# EAGLE schematic controller (EAGLE 7.0.0)
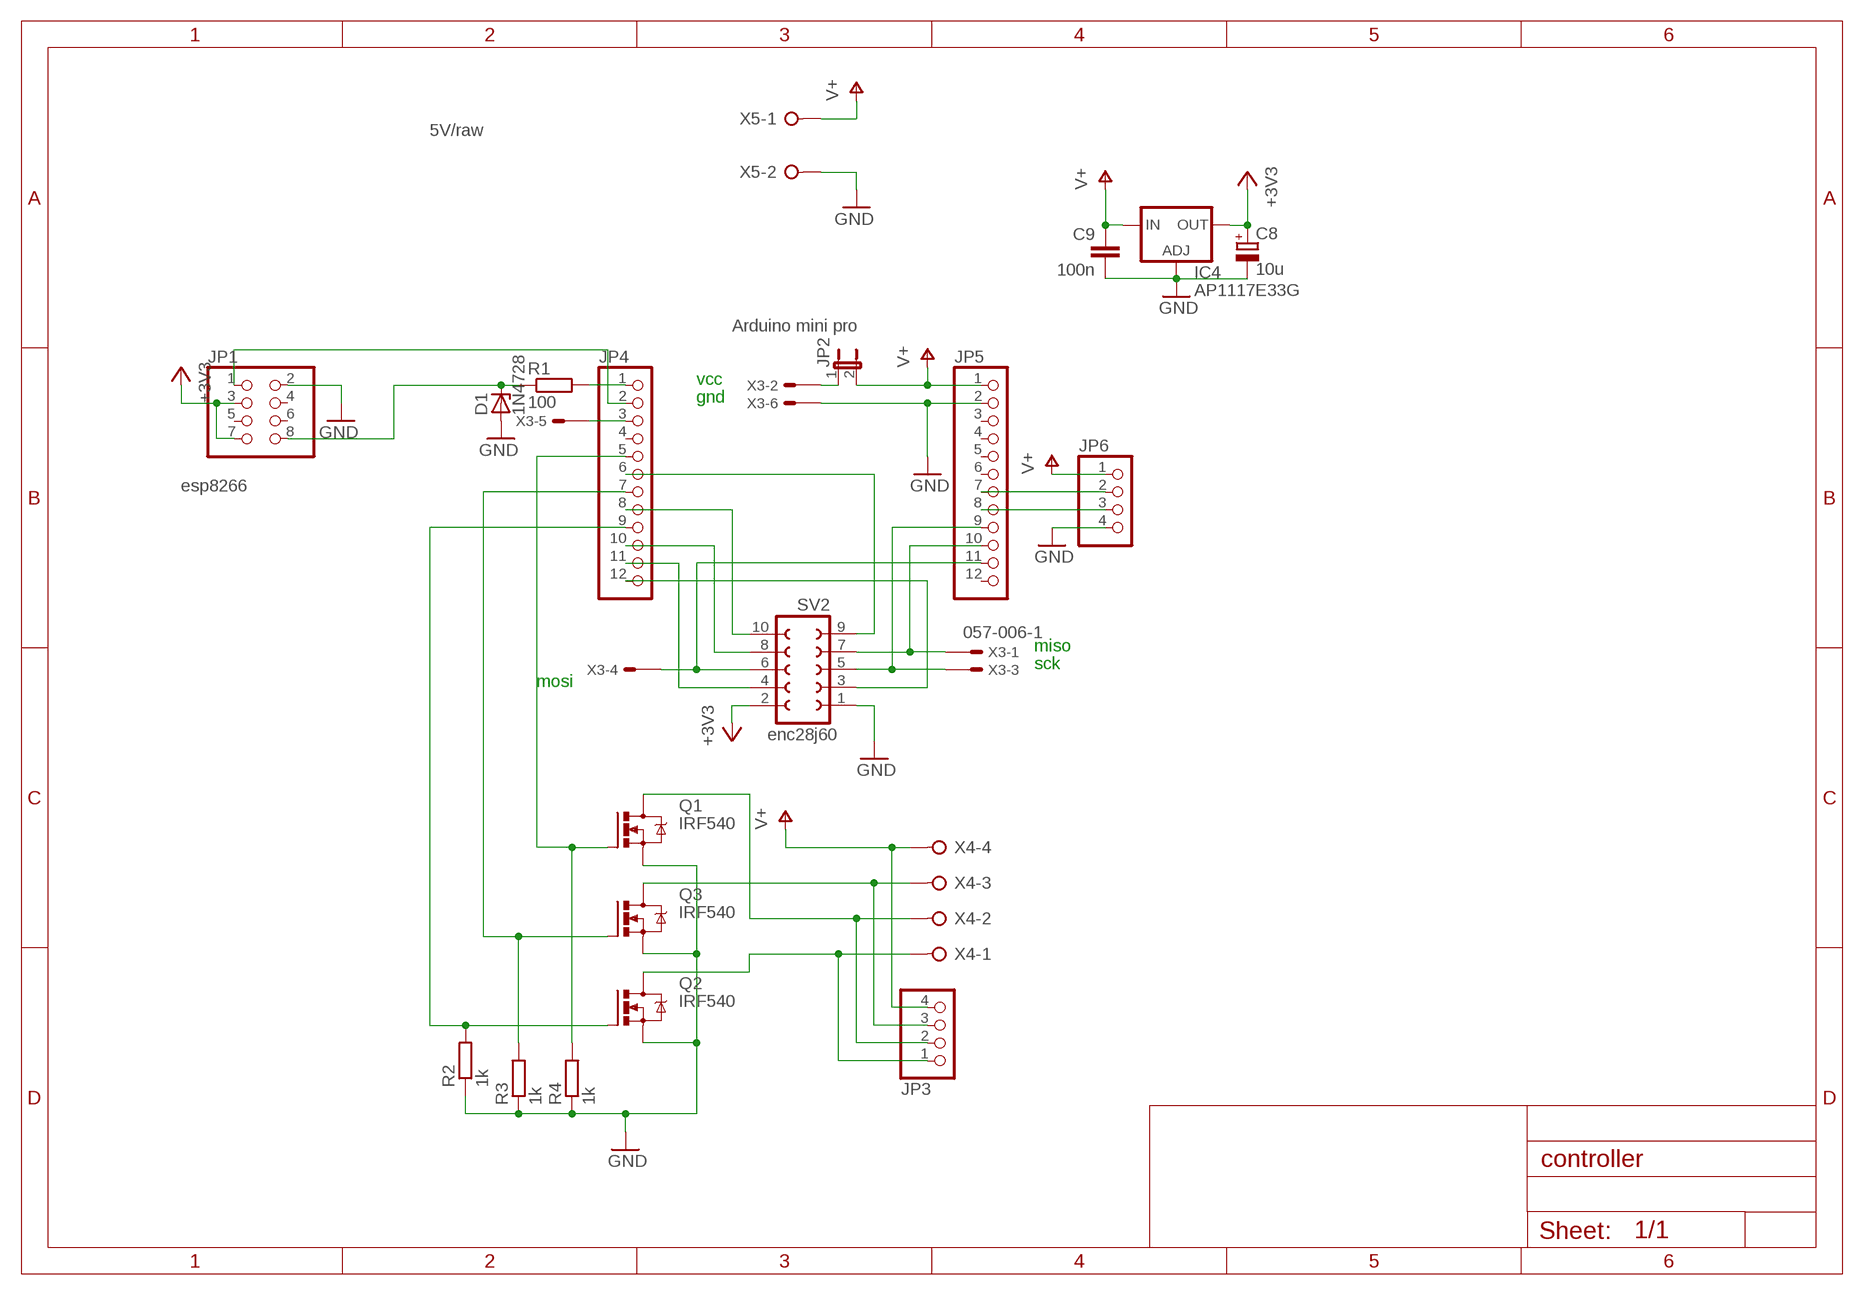
[diagram p0: schematic, sheet 1]

## Parts
C8  10u  CPOL-EUTT2D4L  [TT2D4L]
C9  100n  C-EU025-025X050  [C025-025X050]
D1  1N4728  [DO41Z10]
IC4  AP1117E33G  LD117AS33TR  [SOT223]
JP1  PINHD-2X4  [2X04]
JP2  JP1E  [JP1]
JP3  PINHD-1X4  [1X04]
JP4  PINHD-1X12  [1X12]
JP5  PINHD-1X12  [1X12]
JP6  PINHD-1X4  [1X04]
Q1  IRF540  [TO220BV]
Q2  IRF540  [TO220BV]
Q3  IRF540  [TO220BV]
R1  100  R-EU_0207/10  [0207/10]
R2  1k  R-EU_M0805  [M0805]
R3  1k  R-EU_M0805  [M0805]
R4  1k  R-EU_M0805  [M0805]
SV2  FE05-2  [FE05-2]
X3  057-006-1  [057-006-1]
X4  W237-04P  [W237-4P]
X5  W237-02P  [W237-132]

## Nets
+3V3: C8.+ IC4.2(OUT) IC4.4(OUT) JP1.3 JP1.7 SV2.2
GND: C8.- C9.2 D1.A IC4.1(ADJ) JP1.2 JP5.2 JP6.4 Q1.S Q2.S Q3.S R2.1 R3.1 R4.1 SV2.1 X3.6 X5.2
N$1: JP4.1 R1.2
N$2: JP4.3 X3.5
N$4: JP5.9 SV2.5 X3.3
N$5: JP5.10 SV2.7 X3.1
N$6: D1.C JP1.8 R1.1
N$7: JP4.9 Q2.G R2.2
N$8: JP1.1 JP4.2
N$9: JP3.1 Q2.D X4.1
N$10: JP3.2 Q3.D X4.2
N$11: JP3.3 Q1.D X4.3
N$15: JP5.11 SV2.6 X3.4
N$16: JP4.5 Q1.G R4.2
N$17: JP4.7 Q3.G R3.2
N$19: JP4.12 SV2.3
N$20: JP4.6 SV2.9
N$21: JP4.11 SV2.4
N$22: JP4.10 SV2.8
N$23: JP4.8 SV2.10
N$53: JP2.1 X3.2
N$54: JP5.7 JP6.2
N$55: JP5.8 JP6.3
V+: C9.1 IC4.3(IN) JP2.2 JP3.4 JP5.1 JP6.1 X4.4 X5.1
Unconnected: JP1.4 JP1.5 JP1.6 JP4.4 JP5.3 JP5.4 JP5.5 JP5.6 JP5.12

## Notes on the sheet
- 5V/raw
- Arduino mini pro
- vcc
- gnd
- esp8266
- miso
- sck
- mosi
- enc28j60

## Library data of the parts
C8 = rcl:CPOL-EU: POLARIZED CAPACITOR, European symbol
C9 = rcl:C-EU: CAPACITOR, European symbol
D1 = diode:1N4728: Z DIODE 3.3 V, 1W, 5 percent
IC4 = v-reg:LD117A?*: Low drop fixed and adjustable positive voltage regulators 1 A Source: http://www.st.com/stonline/products/literature/ds/7194/ld1117axx.pdf
JP1 = pinhead:PINHD-2X4: PIN HEADER
JP2 = jumper:JP1E: JUMPER
JP3 JP6 = pinhead:PINHD-1X4: PIN HEADER
JP4 JP5 = pinhead:PINHD-1X12: PIN HEADER
Q1-Q3 = transistor-power:IRF540: HEXFET Power MOSFET
R1-R4 = rcl:R-EU_: RESISTOR, European symbol
SV2 = con-lsta:FE05-2: FEMALE HEADER; OC_FARNELL: unknown; OC_NEWARK: unknown
X3 = con-panduit:057-006-: CONNECTOR 6-pin series 057 contact pc board low profile headers; OC_FARNELL: unknown; OC_NEWARK: unknown
X4 = con-wago-508:W237-04P: WAGO SREW CLAMP; OC_FARNELL: unknown; OC_NEWARK: unknown
X5 = con-wago-508:W237-02P: WAGO SREW CLAMP; OC_FARNELL: unknown; OC_NEWARK: unknown

## Net classes
0 default: clearance 0.205 mm